# Altium schematic sheet MCPS Power 030414.SchDoc
size A4
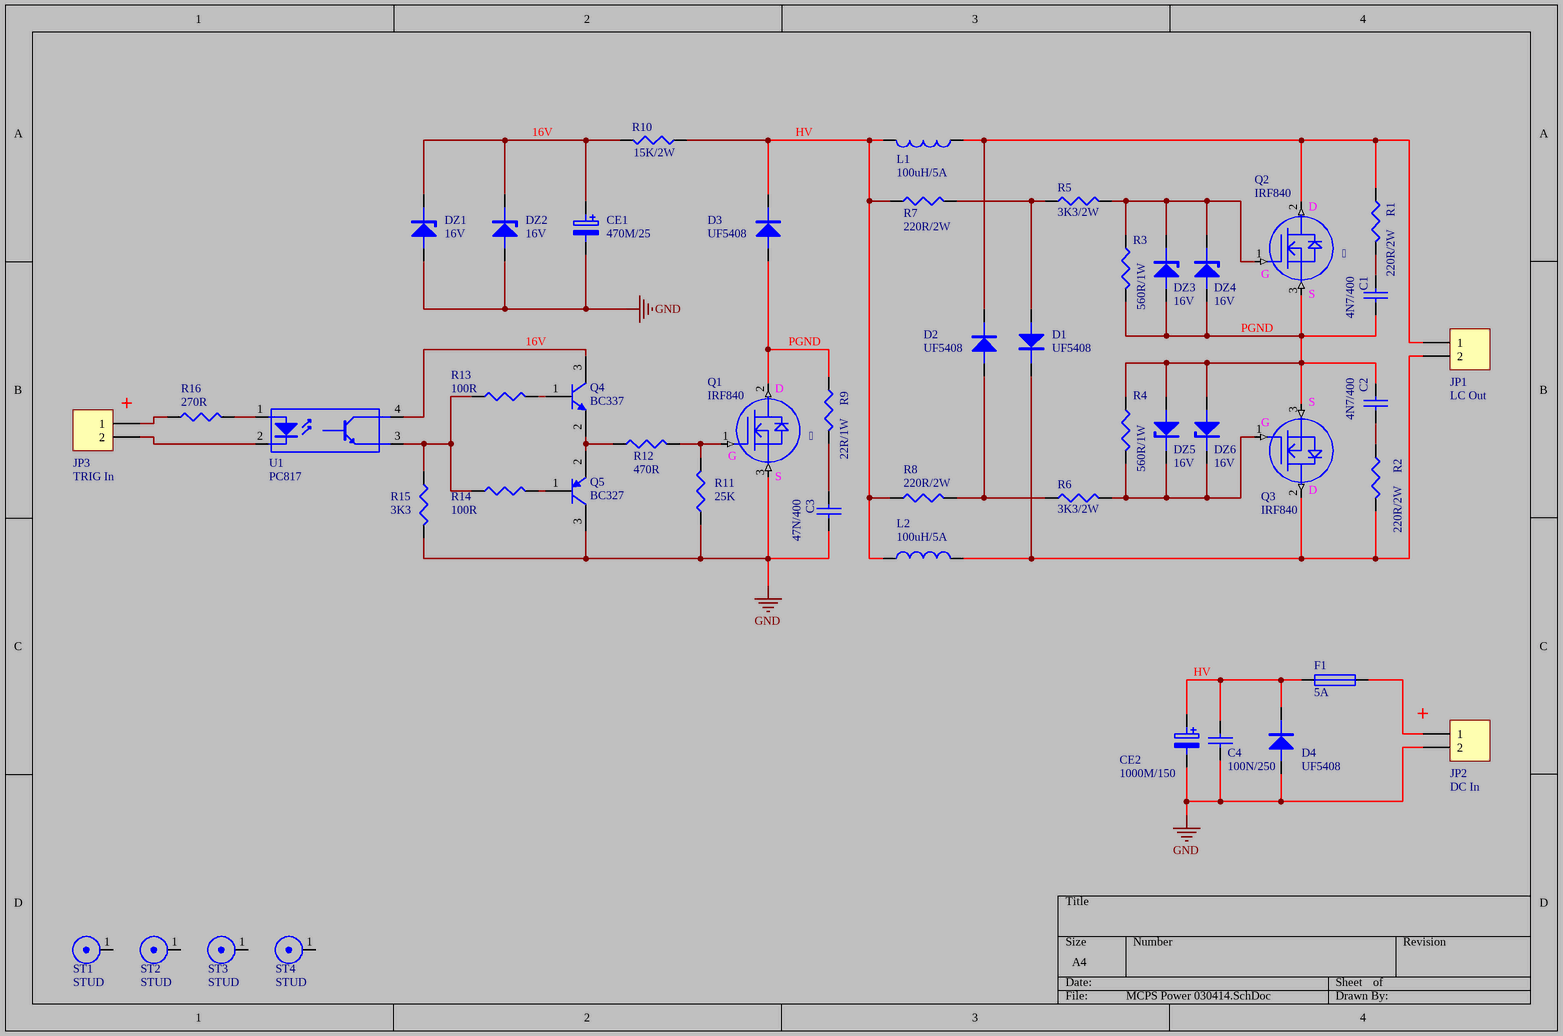
[diagram p0: MCPS Power 030414.SchDoc]

## Parts
C1  4N7/400  [C3P]
C2  4N7/400  [C3P]
C3  47N/400  [C2P]
C4  100N/250  [C4P]
CE1  470M/25  [cap2p12]
CE2  1000M/150  [CAP3P5]
D1  UF5408  [D54]
D2  UF5408  [D54]
D3  UF5408  [D54]
D4  UF5408  [D54]
DZ1  16V  [D5P]
DZ2  16V  [D5P]
DZ3  16V  [D5P]
DZ4  16V  [D5P]
DZ5  16V  [D5P]
DZ6  16V  [D5P]
F1  5A  [FS]
JP1  LC Out  [DG55X2]
JP2  DC In  [DG55X2]
JP3  TRIG In  [DSIP2]
L1  100uH/5A  [Inductor3916]
L2  100uH/5A  [Inductor3916]
Q1    [TO247-MOSPIN]
Q2    [TO247-MOSPIN]
Q3  IRF840  [TO247-MOSPIN]
Q4  BC337  [CBE-BC546]
Q5  BC327  [CBE-BC546]
R1  220R/2W  [W2]
R2  220R/2W  [W2]
R3  560R/1W  [W1]
R4  560R/1W  [W1]
R5  3K3/2W  [W2]
R6  3K3/2W  [W2]
R7  220R/2W  [W2]
R8  220R/2W  [W2]
R9  22R/1W  [W1]
R10  15K/2W  [W2]
R11  25K  [W1/4]
R12  470R  [W1/4]
R13  100R  [W1/4]
R14  100R  [W1/4]
R15  3K3  [W1/4]
R16  270R  [W1/4]
ST1  STUD  [CORNER]
ST2  STUD  [CORNER]
ST3  STUD  [CORNER]
ST4  STUD  [CORNER]
U1  PC817  [DIP4]

## Nets
GND: C3.2 C4.2 CE1.2 CE2.2 D4.1(A) DZ1.1(A) DZ2.1(A) JP2.2 Q1.3(S) Q5.3(C) R11.1 R15.2
16V: CE1.1 DZ1.2(K) DZ2.2(K) Q4.3(C) R10.2 U1.4(C)
HV: C4.1 CE2.1 D3.2(K) D4.2(K) F1.1 L1.1 L2.1 R7.1 R8.1 R10.1
PGND: C1.2 C2.2 D3.1(A) DZ3.1(A) DZ4.1(A) DZ5.1(A) DZ6.1(A) Q1.2(D) Q2.3(S) Q3.3(S) R3.2 R4.1 R9.1
NetC1_1: C1.1 R1.2
NetC2_1: C2.1 R2.2
NetC3_1: C3.1 R9.2
NetD1_1: D1.1(A) R5.1 R7.2
NetD1_2: D1.2(K) JP1.2 L2.2 Q3.2(D) R2.1
NetD2_1: D2.1(A) R6.1 R8.2
NetD2_2: D2.2(K) JP1.1 L1.2 Q2.2(D) R1.1
NetDZ3_2: DZ3.2(K) DZ4.2(K) Q2.1(G) R3.1 R5.2
NetDZ5_2: DZ5.2(K) DZ6.2(K) Q3.1(G) R4.2 R6.2
NetF1_2: F1.2 JP2.1
NetJP3_1: JP3.1 R16.1
NetJP3_2: JP3.2 U1.2(K)
NetQ1_1: Q1.1(G) R11.2 R12.2
NetQ4_1: Q4.1(B) R13.2
NetQ4_2: Q4.2(E) Q5.2(B) R12.1
NetQ5_1: Q5.1(E) R14.2
NetR13_1: R13.1 R14.1 R15.1 U1.3(E)
NetR16_2: R16.2 U1.1(A)

Not connected (* = marked no-connect by the designer): ST1 1; ST2 1; ST3 1; ST4 1

## Notes on the sheet
- (near Q2) IRF840
- (near Q2) D
- (near Q2) G
- (near Q2) S
- (near JP3) +
- (near Q1) IRF840
- (near Q1) D
- (near Q3) G
- (near Q3) S
- (near Q1) G
- (near Q1) S
- (near Q3) D
- (near JP2) +

## Library data of the parts
C1-C4 = C
CE1 CE2 = E
D1-D4 = D
  D2-D4: D4P: *
DZ1-DZ6 = DZ
F1 = FUSE1
JP1-JP3 = Header 2: Header, 2-Pin; LatestRevisionDate: 17-Jul-2002; LatestRevisionNote: Re-released for DXP Platform.; Publisher: Altium Limited
L1 L2 = INDUCTOR
Q1-Q3 = MOSFET N
Q4 = BC546
Q5 = M6: PNP; Published: 8-Jun-2000; LatestRevisionDate: 15-Jan-2003; LatestRevisionNote: PCB Footprint 'BCY-W3/D4.7' replaced; DatasheetVersion: 1997; PackageVersion: Sep-1998; PackageReference: TO-92A; Publisher: Altium Limited; PackageDescription: TO, Flat Index; 3 In-Line, Axial Leads; Body Dia. 4.5mm; Leads 0.51 x 0.48 mm (max)
R1-R16 = R
U1 = OPTODIP4